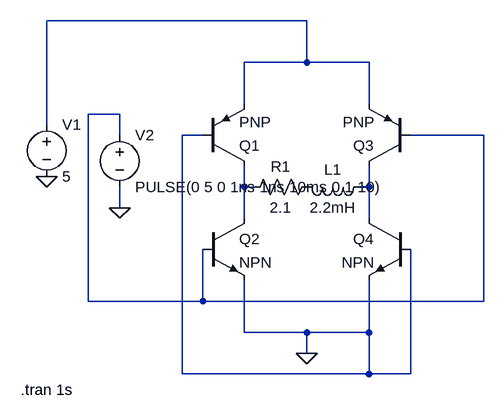
[diagram p0: schematic HBrdige.asc]
HBrdige.asc, the LTspice schematic file:
Version 4.1
SHEET 1 880 680
WIRE 512 -64 112 -64
WIRE 512 0 512 -64
WIRE 512 0 416 0
WIRE 608 0 512 0
WIRE 416 64 416 0
WIRE 608 64 608 0
WIRE 224 80 176 80
WIRE 112 96 112 -64
WIRE 224 112 224 80
WIRE 352 112 320 112
WIRE 784 112 672 112
WIRE 416 192 416 160
WIRE 432 192 416 192
WIRE 608 192 608 160
WIRE 608 192 592 192
WIRE 224 224 224 192
WIRE 416 240 416 192
WIRE 608 240 608 192
WIRE 176 368 176 80
WIRE 352 368 352 288
WIRE 352 368 176 368
WIRE 784 368 784 112
WIRE 784 368 352 368
WIRE 416 416 416 336
WIRE 512 416 416 416
WIRE 608 416 608 336
WIRE 608 416 512 416
WIRE 512 448 512 416
WIRE 320 480 320 112
WIRE 608 480 608 416
WIRE 608 480 320 480
WIRE 672 480 672 288
WIRE 672 480 608 480
FLAG 112 176 0
FLAG 512 448 0
FLAG 224 224 0
SYMBOL voltage 112 80 R0
WINDOW 123 0 0 Left 0
WINDOW 39 0 0 Left 0
SYMATTR InstName V1
SYMATTR Value 5
SYMBOL pnp 352 160 M180
SYMATTR InstName Q1
SYMBOL npn 352 240 R0
SYMATTR InstName Q2
SYMBOL npn 672 240 M0
SYMATTR InstName Q4
SYMBOL pnp 672 160 R180
SYMATTR InstName Q3
SYMBOL ind 608 176 R90
WINDOW 0 5 56 VBottom 2
WINDOW 3 32 56 VTop 2
SYMATTR InstName L1
SYMATTR Value 2.2mH
SYMBOL res 528 176 R90
WINDOW 0 0 56 VBottom 2
WINDOW 3 32 56 VTop 2
SYMATTR InstName R1
SYMATTR Value 2.1
SYMBOL voltage 224 96 R0
WINDOW 123 0 0 Left 0
WINDOW 39 0 0 Left 0
SYMATTR InstName V2
SYMATTR Value PULSE(0 5 0 1ns 1ns 10ms 0.1 10)
TEXT 72 504 Left 2 !.tran 1s

The netlist it stands for:
* HBrdige.asc
V1 N001 0 5
Q1 N003 0 N001 0 PNP
Q2 N003 N002 0 0 NPN
Q4 N004 0 0 0 NPN
Q3 N004 N002 N001 0 PNP
L1 N004 P001 2.2mH
R1 P001 N003 2.1
V2 N002 0 PULSE(0 5 0 1ns 1ns 10ms 0.1 10)
.model NPN NPN
.model PNP PNP
.lib standard.bjt
.tran 1s
.backanno
.end